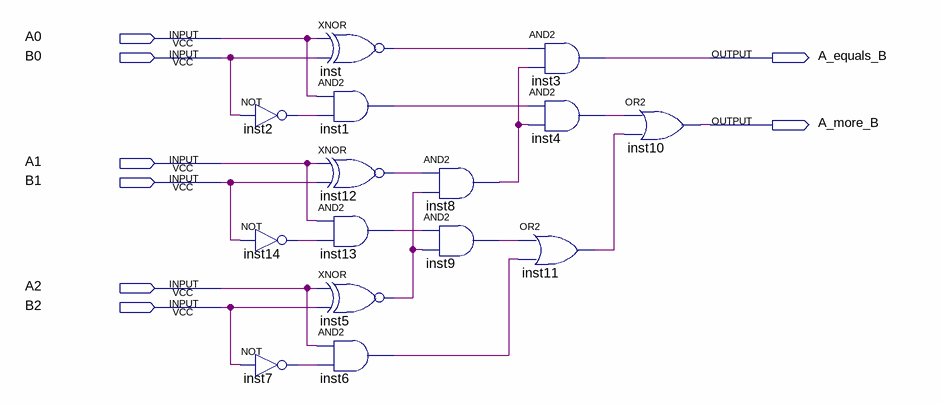
[diagram p0: schematic sheet]
// Quartus schematic Compare.bdf as structural Verilog: 15 symbols, 8 pins
module Compare (
  input  A0,
  input  B0,
  input  A1,
  input  B1,
  input  A2,
  input  B2,
  output A_equals_B,
  output A_more_B
);

  wire inst1_out, inst2_out, inst4_out, inst5_out, inst6_out, inst7_out, inst8_out, inst9_out, inst11_out,
       inst12_out, inst13_out, inst14_out, inst_out;

  not inst2 (inst2_out, B0);
  not inst14 (inst14_out, B1);
  not inst7 (inst7_out, B2);
  xnor inst (inst_out, A0, B0);
  and inst1 (inst1_out, A0, inst2_out);
  xnor inst12 (inst12_out, A1, B1);
  and inst13 (inst13_out, A1, inst14_out);
  xnor inst5 (inst5_out, A2, B2);
  and inst6 (inst6_out, A2, inst7_out);
  and inst8 (inst8_out, inst12_out, inst5_out);
  and inst9 (inst9_out, inst13_out, inst5_out);
  and inst3 (A_equals_B, inst_out, inst8_out);
  and inst4 (inst4_out, inst1_out, inst8_out);
  or inst11 (inst11_out, inst9_out, inst6_out);
  or inst10 (A_more_B, inst4_out, inst11_out);
endmodule
